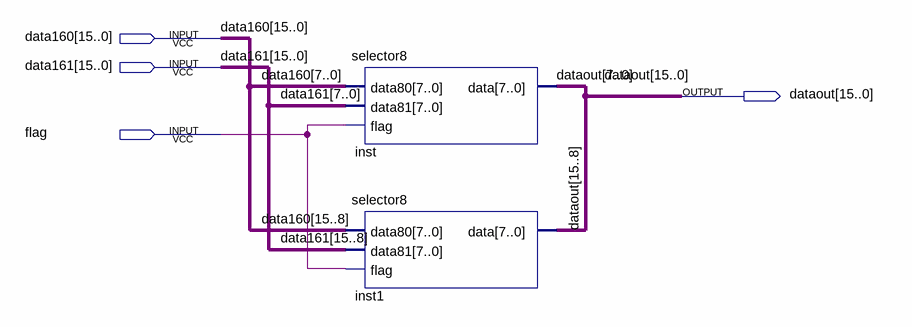
[diagram p0: schematic sheet]
// Quartus schematic selector16.bdf as structural Verilog: 2 symbols, 4 pins
module selector16 (
  input  [15:0] data160,
  input  [15:0] data161,
  input  flag,
  output [15:0] dataout
);

  selector8 inst (.data80(data160[7:0]), .data81(data161[7:0]), .flag(flag), .data(dataout[7:0]));
  selector8 inst1 (.data80(data160[15:8]), .data81(data161[15:8]), .flag(flag), .data(dataout[15:8]));
endmodule
